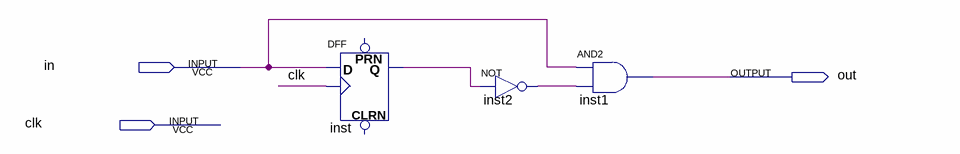
[diagram p0: schematic sheet]
// Quartus schematic RisingEdge.bdf as structural Verilog: 3 symbols, 3 pins
module RisingEdge (
  input  in,
  input  clk,
  output out
);

  wire inst2_out, inst_q;

  DFF inst (.CLK(clk), .D(in), .Q(inst_q));  // open: CLRN, PRN
  not inst2 (inst2_out, inst_q);
  and inst1 (out, in, inst2_out);
endmodule
